# EAGLE schematic MAKER-UNO-X (EAGLE 7.7.0)
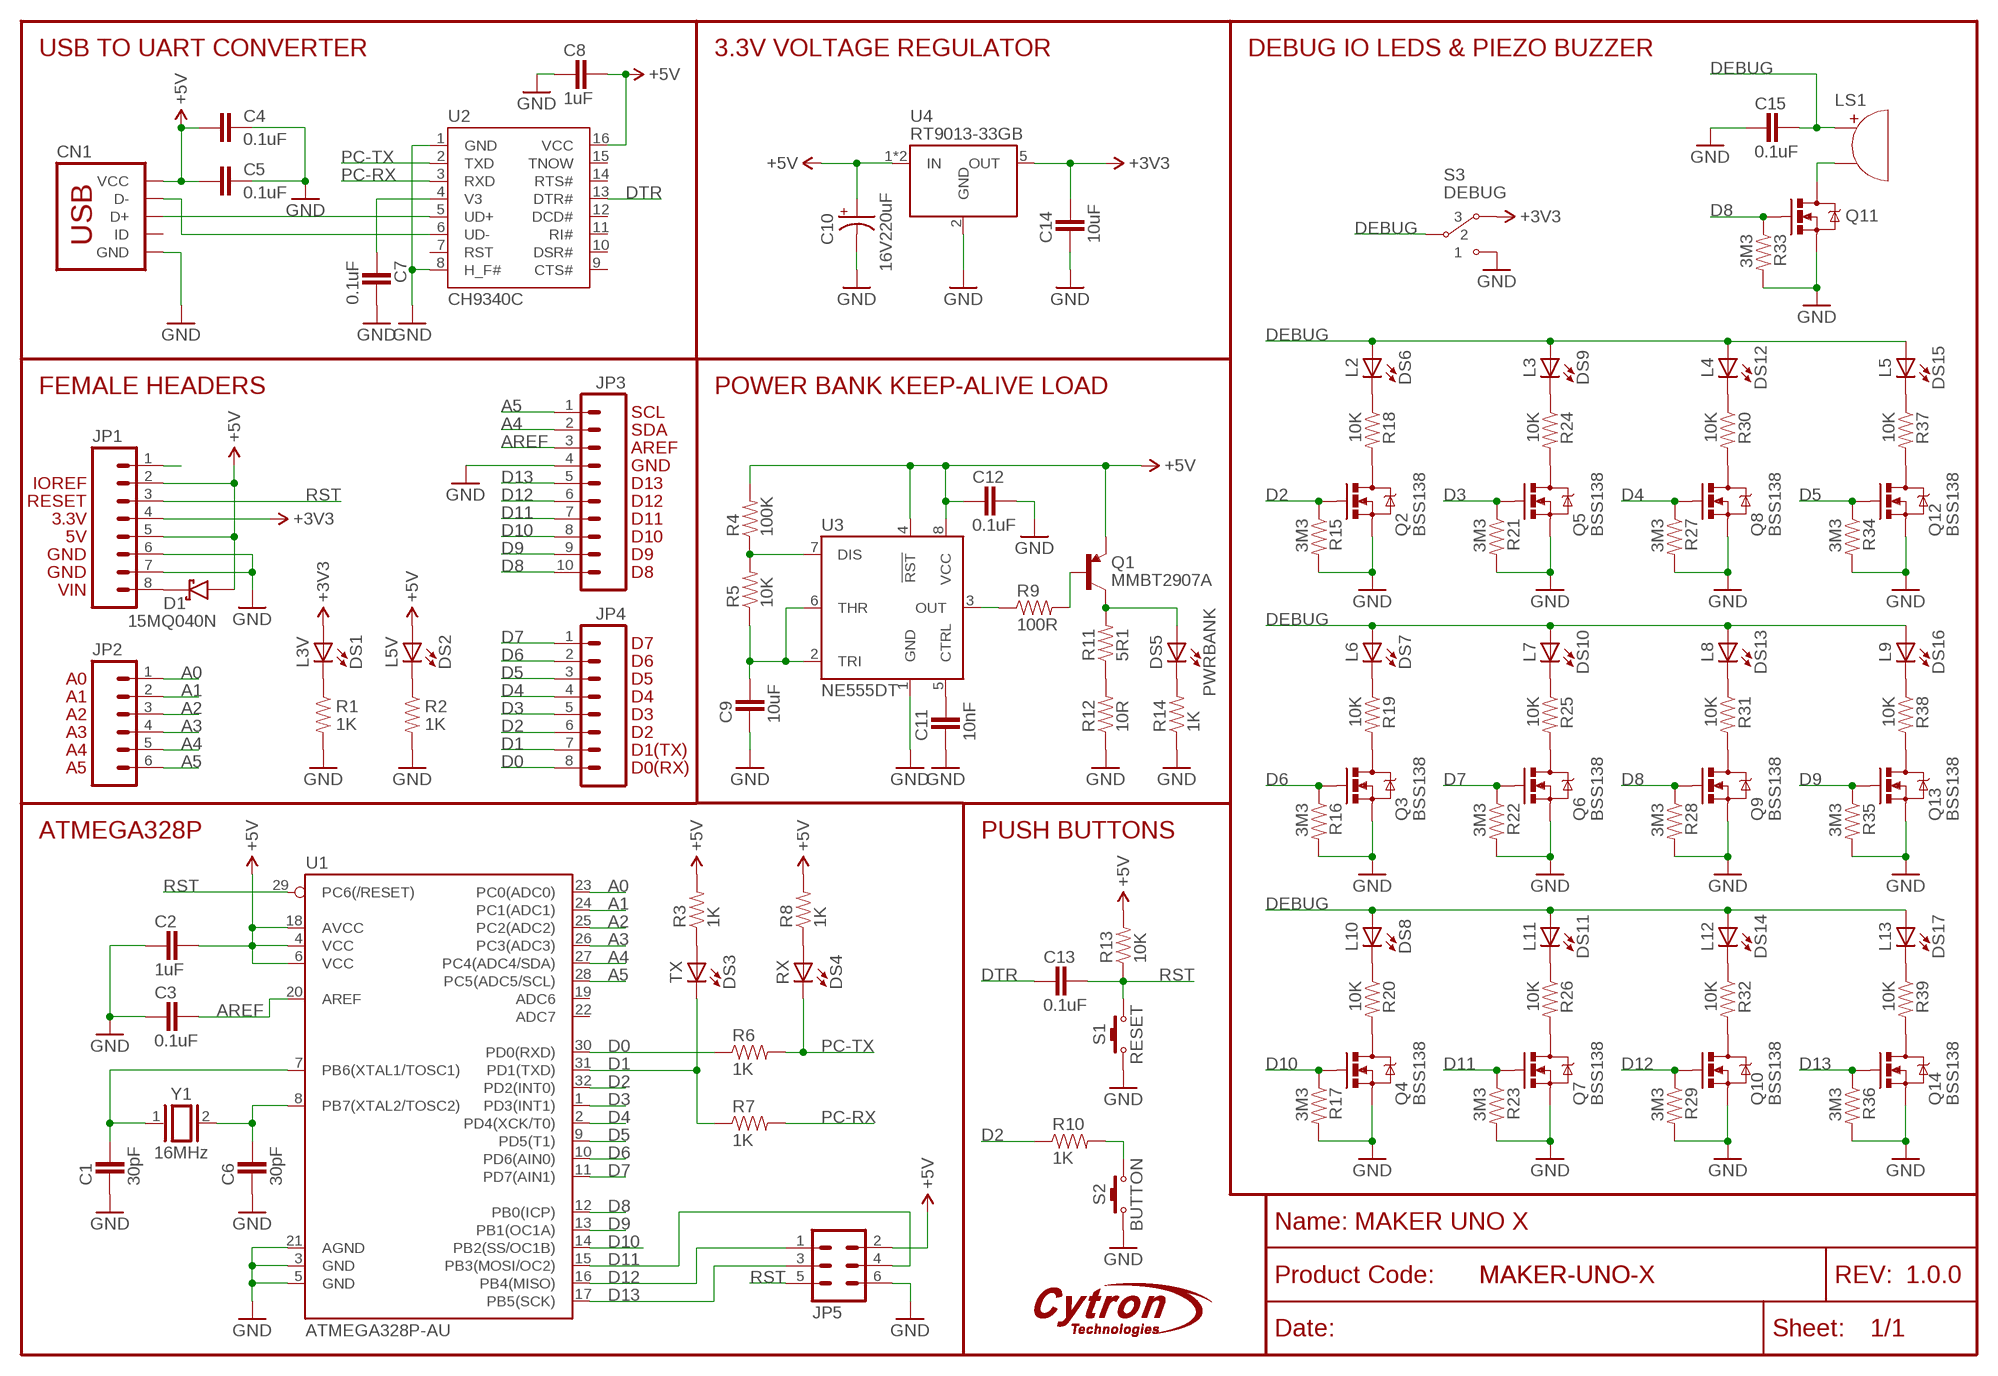
[diagram p0: schematic, sheet 1]

## Parts
C1  30pF  CAP-C_30PF_(1608)  [1608]
C2  1uF  CAP-C_1UF_(1608)  [1608]
C3  0.1uF  CAP-C_0.1UF_(1608)  [1608]
C4  0.1uF  CAP-C_0.1UF_(1608)  [1608]
C5  0.1uF  CAP-C_0.1UF_(1608)  [1608]
C6  30pF  CAP-C_30PF_(1608)  [1608]
C7  0.1uF  CAP-C_0.1UF_(1608)  [1608]
C8  1uF  CAP-C_1UF_(1608)  [1608]
C9  10uF  CAP-C_10UF_(2012)  [2012]
C10  16V220uF  CAP-E-ALUMINIUM_16V220UF_(CHEMICON-F55)  [ECAP-CHEMICON-F]
C11  10nF  CAP-C_10NF_(1608)  [1608]
C12  0.1uF  CAP-C_0.1UF_(1608)  [1608]
C13  0.1uF  CAP-C_0.1UF_(1608)  [1608]
C14  10uF  CAP-C_10UF_(2012)  [2012]
C15  0.1uF  CAP-C_0.1UF_(1608)  [1608]
CN1  USB-5PIN_(MICRO-B-RA)  [USB-MICRO-B-REC]
D1  40V 3A  DIODE-SCHOTTKY_15MQ040N_(SMA)  [D-SMA]
DS1  Green  LED_GREEN_(1608)  [LED-1608]
DS2  Green  LED_GREEN_(1608)  [LED-1608]
DS3  Red  LED_RED_(1608)  [LED-1608]
DS4  Yellow  LED_YELLOW_(1608)  [LED-1608]
DS5  Red  LED_RED_(1608)  [LED-1608]
DS6  Blue  LED_BLUE_(1608)  [LED-1608]
DS7  Blue  LED_BLUE_(1608)  [LED-1608]
DS8  Blue  LED_BLUE_(1608)  [LED-1608]
DS9  Blue  LED_BLUE_(1608)  [LED-1608]
DS10  Blue  LED_BLUE_(1608)  [LED-1608]
DS11  Blue  LED_BLUE_(1608)  [LED-1608]
DS12  Blue  LED_BLUE_(1608)  [LED-1608]
DS13  Blue  LED_BLUE_(1608)  [LED-1608]
DS14  Blue  LED_BLUE_(1608)  [LED-1608]
DS15  Blue  LED_BLUE_(1608)  [LED-1608]
DS16  Blue  LED_BLUE_(1608)  [LED-1608]
DS17  Blue  LED_BLUE_(1608)  [LED-1608]
JP1  8 Ways  HEADER-1X08_(SMD-FEMALE-TYPE1)  [S-HDR-F1X08]
JP2  6 Ways  HEADER-1X06_(SMD-FEMALE-TYPE1)  [S-HDR-F1X06]
JP3  10 Ways  HEADER-1X10_(SMD-FEMALE-TYPE1)  [S-HDR-F1X10]
JP4  8 Ways  HEADER-1X08_(SMD-FEMALE-TYPE1)  [S-HDR-F1X08]
JP5  2x3 Ways  HEADER-2X03_(S-HDR-M2X03)  [S-HDR-M2X03]
LS1  BUZZER_(8530)  [S-BUZZER-HXD-8530A-03627]
Q1  60V 600mA  TRANSISTOR-PNP_MMBT2907_(SOT-23-BEC)  [SOT-23]
Q2  50V 220mA  MOSFET-N_BSS138_(SOT-23)  [SOT-23]
Q3  50V 220mA  MOSFET-N_BSS138_(SOT-23)  [SOT-23]
Q4  50V 220mA  MOSFET-N_BSS138_(SOT-23)  [SOT-23]
Q5  50V 220mA  MOSFET-N_BSS138_(SOT-23)  [SOT-23]
Q6  50V 220mA  MOSFET-N_BSS138_(SOT-23)  [SOT-23]
Q7  50V 220mA  MOSFET-N_BSS138_(SOT-23)  [SOT-23]
Q8  50V 220mA  MOSFET-N_BSS138_(SOT-23)  [SOT-23]
Q9  50V 220mA  MOSFET-N_BSS138_(SOT-23)  [SOT-23]
Q10  50V 220mA  MOSFET-N_BSS138_(SOT-23)  [SOT-23]
Q11  50V 220mA  MOSFET-N_BSS138_(SOT-23)  [SOT-23]
Q12  50V 220mA  MOSFET-N_BSS138_(SOT-23)  [SOT-23]
Q13  50V 220mA  MOSFET-N_BSS138_(SOT-23)  [SOT-23]
Q14  50V 220mA  MOSFET-N_BSS138_(SOT-23)  [SOT-23]
R1  1K  RESISTOR_1K_(1608)  [1608]
R2  1K  RESISTOR_1K_(1608)  [1608]
R3  1K  RESISTOR_1K_(1608)  [1608]
R4  100K  RESISTOR_100K_(1608)  [1608]
R5  10K  RESISTOR_10K_(1608)  [1608]
R6  1K  RESISTOR_1K_(1608)  [1608]
R7  1K  RESISTOR_1K_(1608)  [1608]
R8  1K  RESISTOR_1K_(1608)  [1608]
R9  100R  RESISTOR_100R_(1608)  [1608]
R10  1K  RESISTOR_1K_(1608)  [1608]
R11  5R1  RESISTOR_5R1_(2012)  [2012]
R12  10R  RESISTOR_10R_(2012)  [2012]
R13  10K  RESISTOR_10K_(1608)  [1608]
R14  1K  RESISTOR_1K_(1608)  [1608]
R15  3M3  RESISTOR_3M3_(1608)  [1608]
R16  3M3  RESISTOR_3M3_(1608)  [1608]
R17  3M3  RESISTOR_3M3_(1608)  [1608]
R18  10K  RESISTOR_10K_(1608)  [1608]
R19  10K  RESISTOR_10K_(1608)  [1608]
R20  10K  RESISTOR_10K_(1608)  [1608]
R21  3M3  RESISTOR_3M3_(1608)  [1608]
R22  3M3  RESISTOR_3M3_(1608)  [1608]
R23  3M3  RESISTOR_3M3_(1608)  [1608]
R24  10K  RESISTOR_10K_(1608)  [1608]
R25  10K  RESISTOR_10K_(1608)  [1608]
R26  10K  RESISTOR_10K_(1608)  [1608]
R27  3M3  RESISTOR_3M3_(1608)  [1608]
R28  3M3  RESISTOR_3M3_(1608)  [1608]
R29  3M3  RESISTOR_3M3_(1608)  [1608]
R30  10K  RESISTOR_10K_(1608)  [1608]
R31  10K  RESISTOR_10K_(1608)  [1608]
R32  10K  RESISTOR_10K_(1608)  [1608]
R33  3M3  RESISTOR_3M3_(1608)  [1608]
R34  3M3  RESISTOR_3M3_(1608)  [1608]
R35  3M3  RESISTOR_3M3_(1608)  [1608]
R36  3M3  RESISTOR_3M3_(1608)  [1608]
R37  10K  RESISTOR_10K_(1608)  [1608]
R38  10K  RESISTOR_10K_(1608)  [1608]
R39  10K  RESISTOR_10K_(1608)  [1608]
S1  SW-PB_(KAN3246)  [SW-PB-KAN3246]
S2  SW-PB_(KAN3246)  [SW-PB-KAN3246]
S3  SW-SLIDE-SPDT_(SMD)  [SW-SLIDE-SPDT-SMD]
U1  ATMEGA328_SMT  [TQFP-32-08]
U2  CH9340C  [SOIC-16N]
U3  555_(SOIC-08N)  [SOIC-08N]
U4  3.3V 500mA  VREG_RT9013-33GB_(SOT-23-5)  [SOT-23-5]
Y1  16MHz  XTAL_16MHZ_(SMD-HC49UP)  [XTAL-HC49UP]

## Nets
+3V3: C14.1 DS1.A JP1.4 S3.3 U4.5(OUT)
+5V: C2.1 C4.1 C5.1 C8.1 C10.+ C12.2 CN1.VBUS1(VCC) D1.A DS2.A JP1.2 JP1.5 JP5.2 Q1.2(E) R3.2 R4.2 R8.2 R13.2 U1.4(VCC) U1.6(VCC) U1.18(AVCC) U2.16(VCC) U3.4(!RST) U3.8(VCC) U4.1(IN) U4.3(IN)
A0: JP2.1 U1.23(PC0(ADC0))
A1: JP2.2 U1.24(PC1(ADC1))
A2: JP2.3 U1.25(PC2(ADC2))
A3: JP2.4 U1.26(PC3(ADC3))
A4: JP2.5 JP3.2 U1.27(PC4(ADC4/SDA))
A5: JP2.6 JP3.1 U1.28(PC5(ADC5/SCL))
AREF: C3.1 JP3.3 U1.20(AREF)
D0: JP4.8 R6.1 U1.30(PD0(RXD))
D1: DS3.C JP4.7 R7.1 U1.31(PD1(TXD))
D2: JP4.6 Q2.1(G) R10.1 R15.1 U1.32(PD2(INT0))
D3: JP4.5 Q5.1(G) R21.1 U1.1(PD3(INT1))
D4: JP4.4 Q8.1(G) R27.1 U1.2(PD4(XCK/T0))
D5: JP4.3 Q12.1(G) R34.1 U1.9(PD5(T1))
D6: JP4.2 Q3.1(G) R16.1 U1.10(PD6(AIN0))
D7: JP4.1 Q6.1(G) R22.1 U1.11(PD7(AIN1))
D8: JP3.10 Q9.1(G) Q11.1(G) R28.1 R33.1 U1.12(PB0(ICP))
D9: JP3.9 Q13.1(G) R35.1 U1.13(PB1(OC1A))
D10: JP3.8 Q4.1(G) R17.1 U1.14(PB2(SS/OC1B))
D11: JP3.7 JP5.4 Q7.1(G) R23.1 U1.15(PB3(MOSI/OC2))
D12: JP3.6 JP5.1 Q10.1(G) R29.1 U1.16(PB4(MISO))
D13: JP3.5 JP5.3 Q14.1(G) R36.1 U1.17(PB5(SCK))
DEBUG: C15.1 DS6.A DS7.A DS8.A DS9.A DS10.A DS11.A DS12.A DS13.A DS14.A DS15.A DS16.A DS17.A LS1.+ S3.2
DTR: C13.2 U2.13(DTR#)
GND: C1.2 C2.2 C3.2 C4.2 C5.2 C6.2 C7.1 C8.2 C9.2 C10.- C11.2 C12.1 C14.2 C15.2 CN1.GND1(GND) JP1.6 JP1.7 JP3.4 JP5.6 Q2.2(S) Q3.2(S) Q4.2(S) Q5.2(S) Q6.2(S) Q7.2(S) Q8.2(S) Q9.2(S) Q10.2(S) Q11.2(S) Q12.2(S) Q13.2(S) Q14.2(S) R1.2 R2.2 R12.1 R14.1 R15.2 R16.2 R17.2 R21.2 R22.2 R23.2 R27.2 R28.2 R29.2 R33.2 R34.2 R35.2 R36.2 S1.1 S1.2 S2.1 S2.2 S3.1 U1.3(GND) U1.5(GND) U1.21(AGND) U2.1(GND) U2.8(H_F#) U3.1(GND) U4.2(GND)
L2: Q2.3(D) R18.2
L3: Q5.3(D) R24.2
L4: Q8.3(D) R30.2
L5: Q12.3(D) R37.2
L6: Q3.3(D) R19.2
L7: Q6.3(D) R25.2
L8: Q9.3(D) R31.2
L9: Q13.3(D) R38.2
L10: Q4.3(D) R20.2
L11: Q7.3(D) R26.2
L12: Q10.3(D) R32.2
L13: Q14.3(D) R39.2
N$1: C11.1 U3.5(CTRL)
N$2: DS5.C R14.2
N$3: C7.2 U2.4(V3)
N$4: C6.1 U1.8(PB7(XTAL2/TOSC2)) Y1.2
N$5: C1.1 U1.7(PB6(XTAL1/TOSC1)) Y1.1
N$6: DS3.A R3.1
N$7: JP1.1
N$8: DS4.A R8.1
N$9: R9.1 U3.3(OUT)
N$10: DS17.C R39.1
N$11: DS15.C R37.1
N$12: Q1.1(B) R9.2
N$13: C9.1 R5.1 U3.2(TRI) U3.6(THR)
N$14: R4.1 R5.2 U3.7(DIS)
N$15: DS5.A Q1.3(C) R11.2
N$16: R11.1 R12.2
N$22: DS2.C R2.1
N$23: DS1.C R1.1
N$24: LS1.- Q11.3(D)
N$25: R10.2 S2.3 S2.4
N$58: DS6.C R18.1
N$59: DS9.C R24.1
N$60: DS12.C R30.1
N$61: DS7.C R19.1
N$62: DS10.C R25.1
N$63: DS13.C R31.1
N$64: DS16.C R38.1
N$65: DS8.C R20.1
N$66: DS11.C R26.1
N$67: DS14.C R32.1
PC-RX: R7.2 U2.3(RXD)
PC-TX: DS4.C R6.2 U2.2(TXD)
RST: C13.1 JP1.3 JP5.5 R13.1 S1.3 S1.4 U1.29(PC6(/RESET))
USB+: CN1.D+1(D+) U2.5(UD+)
USB-: CN1.D-1(D-) U2.6(UD-)
VIN: D1.C JP1.8
Unconnected: CN1.ID1(ID) U1.19(ADC6) U1.22(ADC7) U2.7(RST) U2.9(CTS#) U2.10(DSR#) U2.11(RI#) U2.12(DCD#) U2.14(RTS#) U2.15(TNOW)

## Notes on the sheet
- USB TO UART CONVERTER | 3.3V VOLTAGE REGULATOR | DEBUG IO LEDS & PIEZO BUZZER
- FEMALE HEADERS | POWER BANK KEEP-ALIVE LOAD
- SCL
- SDA
- AREF
- GND
- IOREF | D13
- RESET | D12
- 3.3V | D11
- 5V | D10
- GND | D9
- GND | D8
- VIN
- D7
- D6
- A0 | D5
- A1 | D4
- A2 | D3
- A3 | D2
- A4 | D1(TX)
- A5 | D0(RX)
- ATMEGA328P | PUSH BUTTONS
- MAKER UNO X
- MAKER-UNO | 1.0.0

## Library data of the parts
C1 C6 = Others:CAP-C: Ceramic and Multilayer Capacitor; CYTRON-PC: S-CC-30P-63; DESC: S Ceramic Cap 30pF 5% 50V C0G/NP0 0603
C2 C8 = Others:CAP-C: Ceramic and Multilayer Capacitor; CYTRON-PC: S-CC-1U-63; DESC: S C Cap 1uF -20%+80% 10V Y5V 0603
C3-C5 C7 C12 C13 C15 = Others:CAP-C: Ceramic and Multilayer Capacitor; CYTRON-PC: S-CC-100N-63; DESC: S C Cap 0.1uF -20%+80% 50V Y5V 0603
C9 C14 = Others:CAP-C: Ceramic and Multilayer Capacitor; CYTRON-PC: S-CC-10U-85; DESC: S Ceramic Cap 10UF 10% 10V X5R 0805
C10 = Others:CAP-E-ALUMINIUM: Aluminium Electrolytic Capacitor Created by: Wai Weng; CYTRON-PC: S-EC-16-220U-F55; DESC: S Electrolytic Cap 16V 220uF F55
C11 = Others:CAP-C: Ceramic and Multilayer Capacitor; CYTRON-PC: S-CC-10N-63; DESC: S Ceramic Cap 10nF 10% 50V X7R 0603
CN1 = Header and Connector:USB-5PIN: USB Connector - 5 Pins.; CYTRON-PC: S-CN-USB-UB; DESC: USB Connector Micro B (SMD)
D1 = Others:DIODE-SCHOTTKY: Schottky Diode Created by: Wai Weng; CYTRON-PC: S-D-15MQ040N-SMA; DESC: S Schottky Diode 40V 3A 15MQ040N SMA; MPN: 15MQ040N
DS1 = Others:LED: LED; CYTRON-PC: S-DS-G-63; DESC: S LED Green 0603; LABEL: L3V
DS2 = Others:LED: LED; CYTRON-PC: S-DS-G-63; DESC: S LED Green 0603; LABEL: L5V
DS3 = Others:LED: LED; CYTRON-PC: S-DS-R-63; DESC: S LED Red 0603; LABEL: TX
DS4 = Others:LED: LED; CYTRON-PC: S-DS-Y-63; DESC: S LED Yellow 0603; LABEL: RX
DS5 = Others:LED: LED; CYTRON-PC: S-DS-R-63; DESC: S LED Red 0603; LABEL: PWRBANK
DS6 = Others:LED: LED; CYTRON-PC: S-DS-B-63; DESC: S LED Blue 0603; LABEL: L2
DS7 = Others:LED: LED; CYTRON-PC: S-DS-B-63; DESC: S LED Blue 0603; LABEL: L6
DS8 = Others:LED: LED; CYTRON-PC: S-DS-B-63; DESC: S LED Blue 0603; LABEL: L10
DS9 = Others:LED: LED; CYTRON-PC: S-DS-B-63; DESC: S LED Blue 0603; LABEL: L3
DS10 = Others:LED: LED; CYTRON-PC: S-DS-B-63; DESC: S LED Blue 0603; LABEL: L7
DS11 = Others:LED: LED; CYTRON-PC: S-DS-B-63; DESC: S LED Blue 0603; LABEL: L11
DS12 = Others:LED: LED; CYTRON-PC: S-DS-B-63; DESC: S LED Blue 0603; LABEL: L4
DS13 = Others:LED: LED; CYTRON-PC: S-DS-B-63; DESC: S LED Blue 0603; LABEL: L8
DS14 = Others:LED: LED; CYTRON-PC: S-DS-B-63; DESC: S LED Blue 0603; LABEL: L12
DS15 = Others:LED: LED; CYTRON-PC: S-DS-B-63; DESC: S LED Blue 0603; LABEL: L5
DS16 = Others:LED: LED; CYTRON-PC: S-DS-B-63; DESC: S LED Blue 0603; LABEL: L9
DS17 = Others:LED: LED; CYTRON-PC: S-DS-B-63; DESC: S LED Blue 0603; LABEL: L13
JP1 JP4 = Header and Connector:HEADER-1X08: Header - 1X08; CYTRON-PC: S-CN-PH-F108S; DESC: S Straight Female Header 1x8 Ways
JP2 = Header and Connector:HEADER-1X06: Header - 1X06; CYTRON-PC: S-CN-PH-F106S; DESC: S Straight Female Header 1x6 Ways
JP3 = Header and Connector:HEADER-1X10: Header - 1X10; CYTRON-PC: S-CN-PH-F110S; DESC: S Straight Female Header 1x10 Ways
JP5 = Header and Connector:HEADER-2X03: Header - 2X03; CYTRON-PC: S-CN-PH-M203S; DESC: S Straight Male Header 2x3 Ways
LS1 = Others:BUZZER: Piezo Buzzer Created by: Wai Weng; CYTRON-PC: S-BUZZ-HXD8530A; DESC: SMD Buzzer HXD8530A
Q1 = IC & Transistor:TRANSISTOR-PNP: PNP Transistor; CYTRON-PC: S-Q-2907-SOT23; DESC: SMD Transistor - PNP; MF: CHANGJIANG; MPN: MMBT2907A
Q2-Q14 = IC & Transistor:MOSFET-N: N-Channel MOSFET Created by: Wai Weng; CYTRON-PC: S-Q-BSS138-SOT23; DESC: SMD MOSFET - N Channel; MPN: BSS138
R1-R3 R6-R8 R10 R14 = Others:RESISTOR: Resistor; CYTRON-PC: S-R-1K-63; DESC: S Resistor 1K,1%,1/10W,0603
R4 = Others:RESISTOR: Resistor; CYTRON-PC: S-R-100K-63; DESC: S Resistor 100K ,1%,1/10W,0603
R5 R13 R18-R20 R24-R26 R30-R32 R37-R39 = Others:RESISTOR: Resistor; CYTRON-PC: S-R-10K-63; DESC: S Resistor 10K,1%,1/10W,0603
R9 = Others:RESISTOR: Resistor; CYTRON-PC: S-R-100R-63; DESC: S Resistor 100R,1%,1/10W,0603
R11 = Others:RESISTOR: Resistor; CYTRON-PC: S-R-5R1-85; DESC: S Resistor 5.1R,1%,1/8W,0805
R12 = Others:RESISTOR: Resistor; CYTRON-PC: S-R-10-85; DESC: S Resistor 10R,1%,1/8W,0805
R15-R17 R21-R23 R27-R29 R33-R36 = Others:RESISTOR: Resistor; CYTRON-PC: S-R-3M3-63; DESC: S Resistor 3.3M,1%,1/10W,0603
S1 = Others:SW-PB: Momentary Push Button; CYTRON-PC: S-SP-4N-KAN3246; DESC: S Push Button KAN3246 4.2x3.3mm; LABEL: RESET
S2 = Others:SW-PB: Momentary Push Button; CYTRON-PC: S-SP-4N-KAN3246; DESC: S Push Button KAN3246 4.2x3.3mm; LABEL: BUTTON
S3 = Others:SW-SLIDE-SPDT: SMD Slide Switch; CYTRON-PC: S-SS-2C-0307; DESC: Slide Switch 2pin SMD; LABEL: DEBUG
U1 = IC & Transistor:ATMEGA328_SMT: SMD ATmega328P; CYTRON-PC: S-IC-ATMEGA328-TQFP32; DESC: S Microcontroller ATMEGA328P TQFP32; MF: ATMEL; MPN: ATMEGA328P-AU
U2 = IC & Transistor:CH9340C: CH9340C USB to UART Converter Created by: Wai Weng; DESC: S CH9340C USB UART SOIC16; MF: WCH; MPN: CH9340C
U3 = IC & Transistor:555: 555 Timer; CYTRON-PC: S-IC-LM555-SO8; DESC: S Timer LM555 SO8; MF: STMicroelectronics; MPN: NE555DT
U4 = IC & Transistor:VREG: Voltage Regulator- 3 pin Modified by: Wai Weng 1. Renamed the package variant for SOT-223 according to the pin arrangement.; CYTRON-PC: S-VR-RT9013-33GB-SOT23; DESC: S 3.3V Regulator RT9013-33GB SOT23-5; MF: RICHTEK; MPN: RT9013-33GB
Y1 = Others:XTAL: Crystal Oscillator; CYTRON-PC: S-CR-16M-H49S; DESC: S Crystal 16Mhz H49S; MF: TXC; MPN: 9C16000001